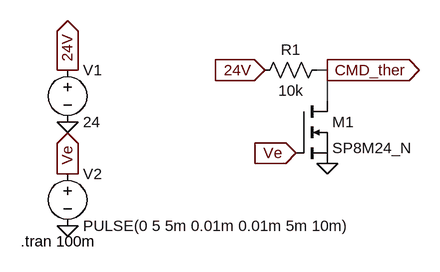
[diagram p0: schematic mosfet_sim.asc]
mosfet_sim.asc, the LTspice schematic file:
Version 4
SHEET 1 880 680
WIRE 144 64 128 64
WIRE 144 112 144 64
FLAG 144 208 0
FLAG 96 192 Ve
IOPIN 96 192 In
FLAG 144 64 CMD_ther
IOPIN 144 64 Out
FLAG 48 64 24V
IOPIN 48 64 In
FLAG -256 144 0
FLAG -256 304 0
FLAG -256 64 24V
IOPIN -256 64 Out
FLAG -256 224 Ve
IOPIN -256 224 Out
SYMBOL nmos 96 112 R0
SYMATTR InstName M1
SYMATTR Value SP8M24_N
SYMBOL res 144 48 R90
WINDOW 0 0 56 VBottom 2
WINDOW 3 32 56 VTop 2
SYMATTR InstName R1
SYMATTR Value 10k
SYMBOL voltage -256 48 R0
WINDOW 123 0 0 Left 0
WINDOW 39 0 0 Left 0
SYMATTR InstName V1
SYMATTR Value 24
SYMBOL voltage -256 208 R0
WINDOW 123 0 0 Left 0
WINDOW 39 0 0 Left 0
SYMATTR InstName V2
SYMATTR Value PULSE(0 5 5m 0.01m 0.01m 5m 10m)
TEXT -328 328 Left 2 !.tran 100m

The netlist it stands for:
* mosfet_sim.asc
M1 CMD_ther Ve 0 0 SP8M24_N
R1 CMD_ther 24V 10k
V1 24V 0 24
V2 Ve 0 PULSE(0 5 5m 0.01m 0.01m 5m 10m)
.model NMOS NMOS
.model PMOS PMOS
.lib standard.mos
.tran 100m
.backanno
.end

* Results of the author's LTspice run, read from the files saved beside the schematic
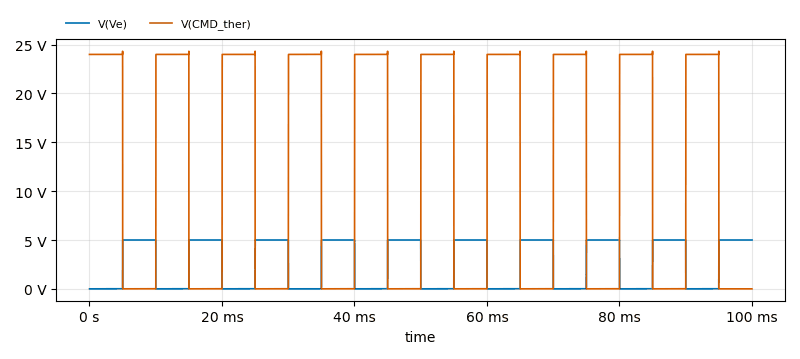
[diagram p1: Transient Analysis of mosfet_sim.asc, plotted from the saved traces]
* Transient Analysis, 1 run:
*   V(Ve): min 0 V, max 5 V, average 2.504 V, rms 3.537 V, last 5 V
*   V(CMD_ther): min 64.93 µV, max 24.33 V, average 11.97 V, rms 16.95 V, last 74.33 µV